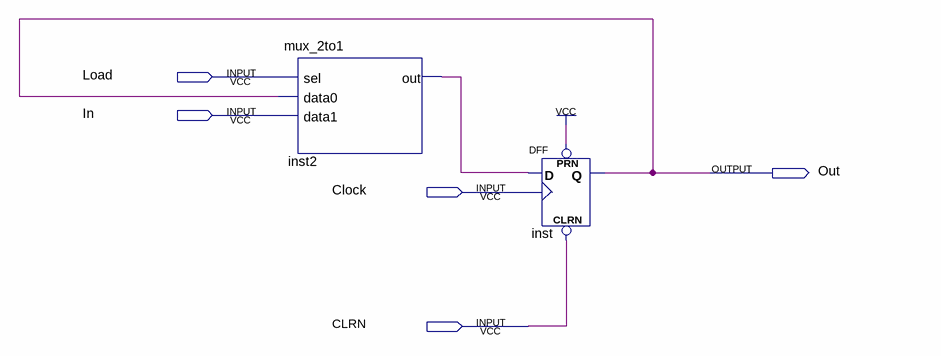
[diagram p0: schematic sheet]
// Quartus schematic register.bdf as structural Verilog: 2 symbols, 5 pins
module register (
  input  Load,
  input  In,
  input  Clock,
  input  CLRN,
  output Out
);

  wire inst2_out;

  mux_2to1 inst2 (.sel(Load), .data0(Out), .data1(In), .out(inst2_out));
  DFF inst (.CLRN(CLRN), .CLK(Clock), .D(inst2_out), .PRN(1'b1), .Q(Out));
endmodule
